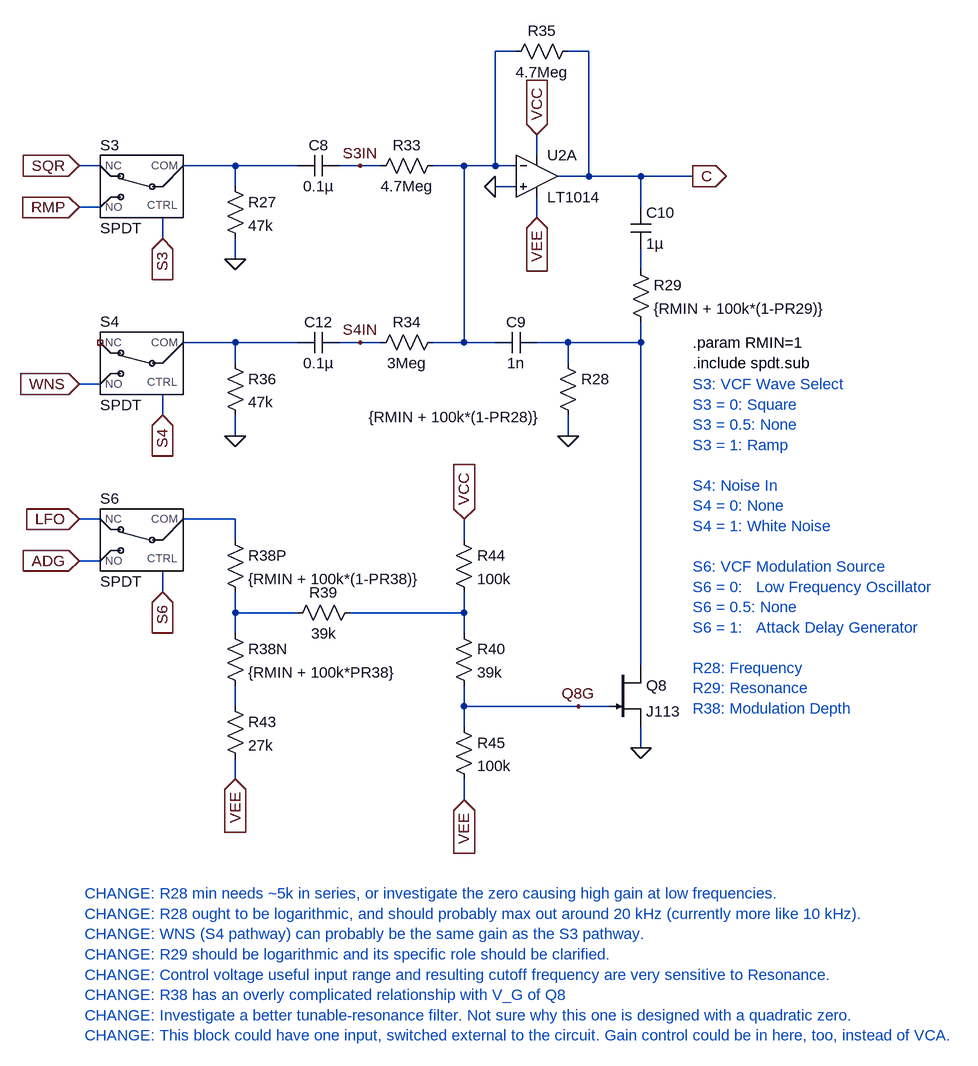
[diagram p0: schematic VCF.asc]
VCF.asc, the LTspice schematic file:
Version 4.1
SHEET 1 2252 1156
WIRE 544 -352 512 -352
WIRE 656 -352 624 -352
WIRE 576 -192 576 -224
WIRE -96 -176 -128 -176
WIRE 112 -176 32 -176
WIRE 208 -176 112 -176
WIRE 304 -176 272 -176
WIRE 336 -176 304 -176
WIRE 464 -176 416 -176
WIRE 512 -176 512 -352
WIRE 512 -176 464 -176
WIRE 544 -176 512 -176
WIRE 656 -160 656 -352
WIRE 656 -160 608 -160
WIRE 736 -160 656 -160
WIRE 816 -160 736 -160
WIRE 112 -144 112 -176
WIRE 544 -144 512 -144
WIRE -96 -112 -128 -112
WIRE 736 -112 736 -160
WIRE 576 -96 576 -128
WIRE 0 -64 0 -96
WIRE 112 -32 112 -64
WIRE 736 -16 736 -48
WIRE 112 96 32 96
WIRE 208 96 112 96
WIRE 304 96 272 96
WIRE 336 96 304 96
WIRE 464 96 464 -176
WIRE 464 96 416 96
WIRE 512 96 464 96
WIRE 624 96 576 96
WIRE 736 96 736 64
WIRE 736 96 624 96
WIRE 112 128 112 96
WIRE 624 128 624 96
WIRE -96 160 -128 160
WIRE 0 208 0 176
WIRE 112 240 112 208
WIRE 624 240 624 208
WIRE -96 368 -128 368
WIRE 112 368 32 368
WIRE 112 400 112 368
WIRE 464 400 464 368
WIRE -96 432 -128 432
WIRE 0 480 0 448
WIRE 112 512 112 480
WIRE 208 512 112 512
WIRE 464 512 464 480
WIRE 464 512 288 512
WIRE 112 544 112 512
WIRE 464 544 464 512
WIRE 736 592 736 96
WIRE 112 656 112 624
WIRE 464 656 464 624
WIRE 640 656 464 656
WIRE 688 656 640 656
WIRE 464 688 464 656
WIRE 736 720 736 688
WIRE 112 768 112 736
WIRE 464 800 464 768
FLAG 0 -64 S3
IOPIN 0 -64 In
FLAG 576 -224 VCC
IOPIN 576 -224 In
FLAG 576 -96 VEE
IOPIN 576 -96 In
FLAG -128 -176 SQR
IOPIN -128 -176 In
FLAG -128 -112 RMP
IOPIN -128 -112 In
FLAG -128 368 LFO
IOPIN -128 368 In
FLAG -128 432 ADG
IOPIN -128 432 In
FLAG -128 160 WNS
IOPIN -128 160 In
FLAG 0 208 S4
IOPIN 0 208 In
FLAG 0 480 S6
IOPIN 0 480 In
FLAG 112 -32 0
FLAG 112 240 0
FLAG 512 -144 0
FLAG 624 240 0
FLAG 112 768 VEE
IOPIN 112 768 In
FLAG 736 720 0
FLAG 816 -160 C
IOPIN 816 -160 Out
FLAG 464 368 VCC
IOPIN 464 368 In
FLAG 464 800 VEE
IOPIN 464 800 In
FLAG 304 -176 S3IN
FLAG 304 96 S4IN
FLAG 640 656 Q8G
SYMBOL njf 688 592 R0
SYMATTR InstName Q8
SYMATTR Value J113
SYMBOL res 96 -160 R0
SYMATTR InstName R27
SYMATTR Value 47k
SYMBOL res 432 -192 R90
WINDOW 0 0 56 VBottom 2
WINDOW 3 32 56 VTop 2
SYMATTR InstName R33
SYMATTR Value 4.7Meg
SYMBOL spdt 0 -144 R0
SYMATTR InstName S3
SYMBOL OpAmps\\LT1014 576 -224 R0
SYMATTR InstName U2A
SYMBOL res 640 -368 R90
WINDOW 0 0 56 VBottom 2
WINDOW 3 32 56 VTop 2
SYMATTR InstName R35
SYMATTR Value 4.7Meg
SYMBOL spdt 0 400 R0
SYMATTR InstName S6
SYMBOL spdt 0 128 R0
SYMATTR InstName S4
SYMBOL cap 272 -192 R90
WINDOW 0 0 32 VBottom 2
WINDOW 3 32 32 VTop 2
SYMATTR InstName C8
SYMATTR Value 0.1µ
SYMBOL res 96 112 R0
SYMATTR InstName R36
SYMATTR Value 47k
SYMBOL res 432 80 R90
WINDOW 0 0 56 VBottom 2
WINDOW 3 32 56 VTop 2
SYMATTR InstName R34
SYMATTR Value 3Meg
SYMBOL cap 272 80 R90
WINDOW 0 0 32 VBottom 2
WINDOW 3 32 32 VTop 2
SYMATTR InstName C12
SYMATTR Value 0.1µ
SYMBOL res 608 112 R0
WINDOW 3 -291 99 Left 2
SYMATTR Value {RMIN + 100k*(1-PR28)}
SYMATTR InstName R28
SYMBOL cap 576 80 R90
WINDOW 0 0 32 VBottom 2
WINDOW 3 32 32 VTop 2
SYMATTR InstName C9
SYMATTR Value 1n
SYMBOL res 96 384 R0
SYMATTR InstName R38P
SYMATTR Value {RMIN + 100k*(1-PR38)}
SYMBOL res 96 528 R0
SYMATTR InstName R38N
SYMATTR Value {RMIN + 100k*PR38}
SYMBOL res 720 -32 R0
SYMATTR InstName R29
SYMATTR Value {RMIN + 100k*(1-PR29)}
SYMBOL cap 720 -112 R0
SYMATTR InstName C10
SYMATTR Value 1µ
SYMBOL res 96 640 R0
SYMATTR InstName R43
SYMATTR Value 27k
SYMBOL res 304 496 R90
WINDOW 0 0 56 VBottom 2
WINDOW 3 32 56 VTop 2
SYMATTR InstName R39
SYMATTR Value 39k
SYMBOL res 448 384 R0
SYMATTR InstName R44
SYMATTR Value 100k
SYMBOL res 448 528 R0
SYMATTR InstName R40
SYMATTR Value 39k
SYMBOL res 448 672 R0
SYMATTR InstName R45
SYMATTR Value 100k
TEXT 816 160 Left 2 ;S3: VCF Wave Select\nS3 = 0: Square\nS3 = 0.5: None\nS3 = 1: Ramp\n \nS4: Noise In\nS4 = 0: None\nS4 = 1: White Noise\n \nS6: VCF Modulation Source\nS6 = 0:   Low Frequency Oscillator\nS6 = 0.5: None\nS6 = 1:   Attack Delay Generator\n \nR28: Frequency\nR29: Resonance\nR38: Modulation Depth
TEXT 816 128 Left 2 !.include spdt.sub
TEXT 816 96 Left 2 !.param RMIN=1
TEXT -120 944 Left 2 ;CHANGE: R28 min needs ~5k in series, or investigate the zero causing high gain at low frequencies.\nCHANGE: R28 ought to be logarithmic, and should probably max out around 20 kHz (currently more like 10 kHz).\nCHANGE: WNS (S4 pathway) can probably be the same gain as the S3 pathway.\nCHANGE: R29 should be logarithmic and its specific role should be clarified.\nCHANGE: Control voltage useful input range and resulting cutoff frequency are very sensitive to Resonance.\nCHANGE: R38 has an overly complicated relationship with V_G of Q8\nCHANGE: Investigate a better tunable-resonance filter. Not sure why this one is designed with a quadratic zero.\nCHANGE: This block could have one input, switched external to the circuit. Gain control could be in here, too, instead of VCA.

The netlist it stands for:
* VCF.asc
J§Q8 N005 Q8G 0 J113
R27 N002 0 47k
R33 N001 S3IN 4.7Meg
X§S3 N002 RMP SQR S3 SPDT  ; pins COM NO NC CTRL
X§U2A 0 N001 VCC VEE C LT1014  ; pins In+ In- V+ V- OUT
R35 C N001 4.7Meg
X§S6 N006 ADG LFO S6 SPDT  ; pins COM NO NC CTRL
X§S4 N004 WNS NC_01 S4 SPDT  ; pins COM NO NC CTRL
C8 S3IN N002 0.1µ
R36 N004 0 47k
R34 N001 S4IN 3Meg
C12 S4IN N004 0.1µ
R28 N005 0 {RMIN + 100k*(1-PR28)}
C9 N005 N001 1n
R38P N006 N007 {RMIN + 100k*(1-PR38)}
R38N N007 N009 {RMIN + 100k*PR38}
R29 N003 N005 {RMIN + 100k*(1-PR29)}
C10 C N003 1µ
R43 N009 VEE 27k
R39 N008 N007 39k
R44 VCC N008 100k
R40 N008 Q8G 39k
R45 Q8G VEE 100k
.model NJF NJF
.model PJF PJF
.lib standard.jft
* S3: VCF Wave Select
* S3 = 0: Square
* S3 = 0.5: None
* S3 = 1: Ramp
* S4: Noise In
* S4 = 0: None
* S4 = 1: White Noise
* S6: VCF Modulation Source
* S6 = 0:   Low Frequency Oscillator
* S6 = 0.5: None
* S6 = 1:   Attack Delay Generator
* R28: Frequency
* R29: Resonance
* R38: Modulation Depth
.include spdt.sub
.param RMIN=1
* CHANGE: R28 min needs ~5k in series, or investigate the zero causing high gain at low frequencies.
* CHANGE: R28 ought to be logarithmic, and should probably max out around 20 kHz (currently more like 10 kHz).
* CHANGE: WNS (S4 pathway) can probably be the same gain as the S3 pathway.
* CHANGE: R29 should be logarithmic and its specific role should be clarified.
* CHANGE: Control voltage useful input range and resulting cutoff frequency are very sensitive to Resonance.
* CHANGE: R38 has an overly complicated relationship with V_G of Q8
* CHANGE: Investigate a better tunable-resonance filter. Not sure why this one is designed with a quadratic zero.
* CHANGE: This block could have one input, switched external to the circuit. Gain control could be in here, too, instead of VCA.
.backanno
.end